# Altium schematic sheet MICROMOUSE.SchDoc
size A; SheetNumber: 1; SheetTotal: 1
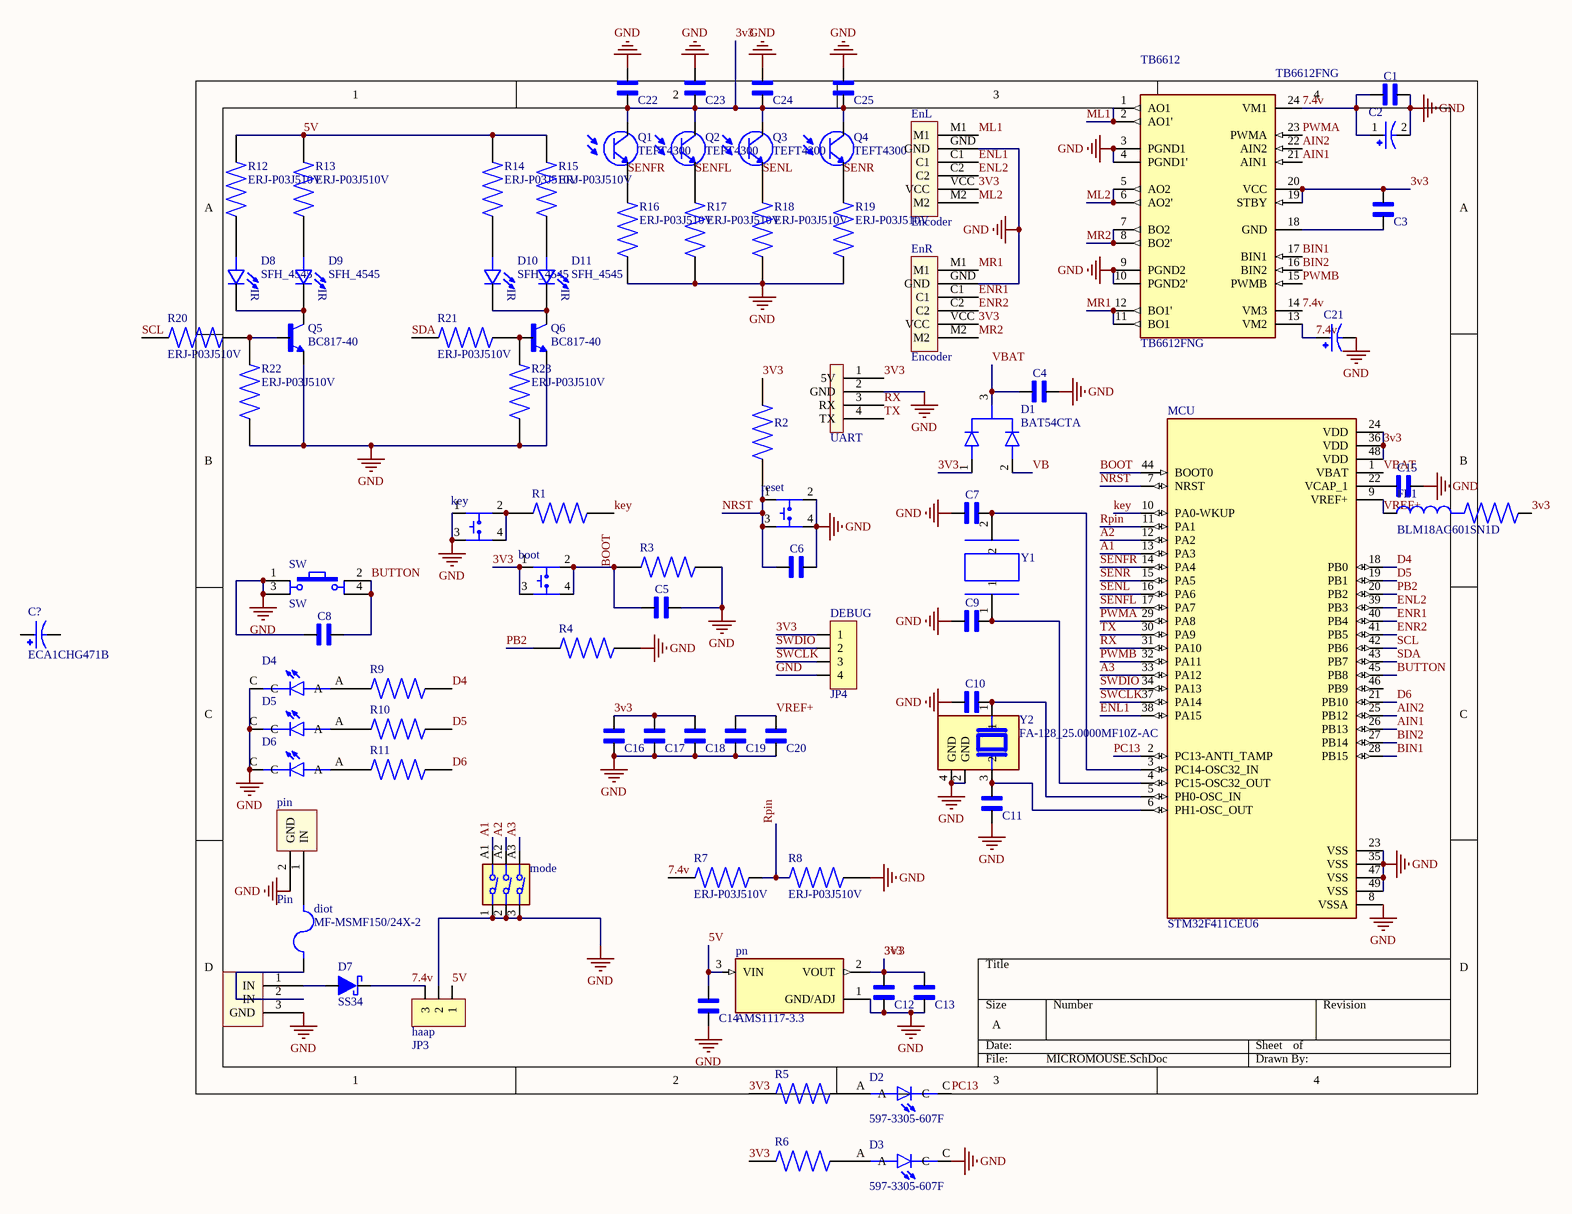
[diagram p0: MICROMOUSE.SchDoc]

## Parts
boot  SKRPACE010  [SW_SKRPACE010]  (value not drawn)
C1  C1608C0G1H100C080AA  [CAPC1608X90N]  (value not drawn)
C2  6TPE220MAZB  [CAP_6TPE220MAZB]  (value not drawn)
C3  C1608C0G1H100C080AA  [CAPC1608X90N]  (value not drawn)
C4  C1608C0G1H100C080AA  [CAPC1608X90N]  (value not drawn)
C5  C1608C0G1H100C080AA  [CAPC1608X90N]  (value not drawn)
C6  C1608C0G1H100C080AA  [CAPC1608X90N]  (value not drawn)
C7  C1608C0G1H100C080AA  [CAPC1608X90N]  (value not drawn)
C8  C1608C0G1H100C080AA  [CAPC1608X90N]  (value not drawn)
C9  C1608C0G1H100C080AA  [CAPC1608X90N]  (value not drawn)
C10  C1608C0G1H100C080AA  [CAPC1608X90N]  (value not drawn)
C11  C1608C0G1H100C080AA  [CAPC1608X90N]  (value not drawn)
C12  C1608C0G1H100C080AA  [CAPC1608X90N]  (value not drawn)
C13  C1608C0G1H100C080AA  [CAPC1608X90N]  (value not drawn)
C14  C1608C0G1H100C080AA  [CAPC1608X90N]  (value not drawn)
C15  C1608C0G1H100C080AA  [CAPC1608X90N]  (value not drawn)
C16  C1608C0G1H100C080AA  [CAPC1608X90N]  (value not drawn)
C17  C1608C0G1H100C080AA  [CAPC1608X90N]  (value not drawn)
C18  C1608C0G1H100C080AA  [CAPC1608X90N]  (value not drawn)
C19  C1608C0G1H100C080AA  [CAPC1608X90N]  (value not drawn)
C20  C1608C0G1H100C080AA  [CAPC1608X90N]  (value not drawn)
C21  EEEFK1C471GV  [CAP_EEEFK1C471GV]  (value not drawn)
C22  C1608C0G1H100C080AA  [CAPC1608X90N]  (value not drawn)
C23  C1608C0G1H100C080AA  [CAPC1608X90N]  (value not drawn)
C24  C1608C0G1H100C080AA  [CAPC1608X90N]  (value not drawn)
C25  C1608C0G1H100C080AA  [CAPC1608X90N]  (value not drawn)
C?  ECA1CHG471B  [CAPPRD500W60D800H1150]
D1  BAT54CTA  [SOT50P160X90-3N]
D2  597-3305-607F  [LEDC2012X70N]
D3  597-3305-607F  [LEDC2012X70N]
D4  597-3305-607F  [LEDC2012X70N]  (value not drawn)
D5  597-3305-607F  [LEDC2012X70N]  (value not drawn)
D6  597-3305-607F  [LEDC2012X70N]  (value not drawn)
D7  SS34  [DO214AB]
D8  SFH_4545  [DIO_SFH_4545]
D9  SFH_4545  [DIO_SFH_4545]
D10  SFH_4545  [DIO_SFH_4545]
D11  SFH_4545  [DIO_SFH_4545]
DEBUG  JP4  [JP4-C1T]
diot  MF-MSMF150/24X-2  [FUSER_MF-MSMF150/24X-2]
EnL  Encoder  [Encoder]
EnR  Encoder  [Encoder]
FL1  BLM18AG601SN1D  [BEADC1608X95N]
haap  JP3  [JP3-C1T]
key  SKRPACE010  [SW_SKRPACE010]  (value not drawn)
MCU  STM32F411CEU6  [QFN50P700X700X60-49N]
mode  418117270903  [418117270903]  (value not drawn)
pin  Pin  [Pin]
pn  AMS1117-3.3  [SOT229P700X180-4N]
Q1  TEFT4300  [XDCR_TEFT4300]
Q2  TEFT4300  [XDCR_TEFT4300]
Q3  TEFT4300  [XDCR_TEFT4300]
Q4  TEFT4300  [XDCR_TEFT4300]
Q5  BC817-40  [SOT95P240X120-3N]
Q6  BC817-40  [SOT95P240X120-3N]
R1  ERJ-P03J510V  [RESC1608X55N]  (value not drawn)
R2  ERJ-P03J510V  [RESC1608X55N]  (value not drawn)
R3  ERJ-P03J510V  [RESC1608X55N]  (value not drawn)
R4  ERJ-P03J510V  [RESC1608X55N]  (value not drawn)
R5  ERJ-P03J510V  [RESC1608X55N]  (value not drawn)
R6  ERJ-P03J510V  [RESC1608X55N]  (value not drawn)
R7  ERJ-P03J510V  [RESC1608X55N]
R8  ERJ-P03J510V  [RESC1608X55N]
R9  ERJ-P03J510V  [RESC1608X55N]  (value not drawn)
R10  ERJ-P03J510V  [RESC1608X55N]  (value not drawn)
R11  ERJ-P03J510V  [RESC1608X55N]  (value not drawn)
R12  ERJ-P03J510V  [RESC1608X55N]
R13  ERJ-P03J510V  [RESC1608X55N]
R14  ERJ-P03J510V  [RESC1608X55N]
R15  ERJ-P03J510V  [RESC1608X55N]
R16  ERJ-P03J510V  [RESC1608X55N]
R17  ERJ-P03J510V  [RESC1608X55N]
R18  ERJ-P03J510V  [RESC1608X55N]
R19  ERJ-P03J510V  [RESC1608X55N]
R20  ERJ-P03J510V  [RESC1608X55N]
R21  ERJ-P03J510V  [RESC1608X55N]
R22  ERJ-P03J510V  [RESC1608X55N]
R23  ERJ-P03J510V  [RESC1608X55N]
reset  SKRPACE010  [SW_SKRPACE010]  (value not drawn)
SW  SW  [SW4]
Sw1  Switch  [Switch]  (value not drawn)
TB6612  TB6612FNG  [SSOP24]
UART  Pin4x  [Pin4x]  (value not drawn)
Y1  ABS07-LR-32.768KHZ-6-T  [XTAL320X150X90]  (value not drawn)
Y2  FA-128_25.0000MF10Z-AC  [XTAL_FA-128_25.0000MF10Z-AC]

## Nets
GND: C1.2 C2.2 C4.2 C5.2 C6.2 C7.1 C8.1 C9.1 C10.1 C11.1 C12.1 C13.1 C14.1 C15.2 C16.1 C17.1 C18.1 C19.1 C20.1 C21.2 C22.2 C23.2 C24.2 C25.2 D3.C D4.C D5.C D6.C DEBUG.4 EnL.GND EnR.GND haap.2 key.1 key.3 MCU.8(VSSA) MCU.23(VSS) MCU.35(VSS) MCU.47(VSS) MCU.49(VSS) mode.1 mode.2 mode.3 pin.2(GND) pn.1(GND/ADJ) Q5.2(E) Q6.2(E) R3.2 R4.2 R8.2 R16.1 R17.1 R18.1 R19.1 R22.1 R23.1 reset.2 reset.4 SW.1 SW.3 Sw1.3(GND) TB6612.3(PGND1) TB6612.4(PGND1') TB6612.9(PGND2) TB6612.10(PGND2') UART.2(GND) Y2.2(GND) Y2.4(GND)
3V3: boot.1 boot.3 C3.2 C12.2 C13.2 C16.2 C17.2 C18.2 C22.1 C23.1 C24.1 C25.1 D1.1 DEBUG.1 EnL.VCC EnR.VCC FL1.2 MCU.24(VDD) MCU.36(VDD) MCU.48(VDD) pn.2(VOUT) Q1.C Q2.C Q3.C Q4.C R2.2 R5.1 R6.1 TB6612.19(STBY) TB6612.20(VCC) UART.1(5V)
5V: C14.2 haap.1 pn.3(VIN) R12.2 R13.2 R14.2 R15.2
7.4v: C1.1 C2.1 C21.1 D7.C haap.3 R7.1 TB6612.13(VM2) TB6612.14(VM3) TB6612.24(VM1)
A1: MCU.13(PA3) mode.A1
A2: MCU.12(PA2) mode.A2
A3: MCU.33(PA12) mode.A3
AIN1: MCU.26(PB13) TB6612.21(AIN1)
AIN2: MCU.25(PB12) TB6612.22(AIN2)
BIN1: MCU.28(PB15) TB6612.17(BIN1)
BIN2: MCU.27(PB14) TB6612.16(BIN2)
BOOT: boot.2 boot.4 C5.1 MCU.44(BOOT0) R3.1
BUTTON: C8.2 MCU.45(PB8) SW.2 SW.4
D4: MCU.18(PB0) R9.2
D5: MCU.19(PB1) R10.2
D6: MCU.21(PB10) R11.2
ENL1: EnL.C1 MCU.38(PA15)
ENL2: EnL.C2 MCU.39(PB3)
ENR1: EnR.C1 MCU.40(PB4)
ENR2: EnR.C2 MCU.41(PB5)
key: MCU.10(PA0-WKUP) R1.2
ML1: EnL.M1 TB6612.1(AO1) TB6612.2(AO1')
ML2: EnL.M2 TB6612.5(AO2) TB6612.6(AO2')
MR1: EnR.M1 TB6612.11(BO1) TB6612.12(BO1')
MR2: EnR.M2 TB6612.7(BO2) TB6612.8(BO2')
NRST: C6.1 MCU.7(NRST) R2.1 reset.1 reset.3
PB2: MCU.20(PB2) R4.1
PC13: D2.C MCU.2(PC13-ANTI_TAMP)
PWMA: MCU.29(PA8) TB6612.23(PWMA)
PWMB: MCU.32(PA11) TB6612.15(PWMB)
Rpin: MCU.11(PA1) R7.2 R8.1
RX: MCU.31(PA10) UART.3(RX)
SCL: MCU.42(PB6) R20.2
SDA: MCU.43(PB7) R21.2
SENFL: MCU.17(PA7) Q2.E R17.2
SENFR: MCU.14(PA4) Q1.E R16.2
SENL: MCU.16(PA6) Q3.E R18.2
SENR: MCU.15(PA5) Q4.E R19.2
SWCLK: DEBUG.3 MCU.37(PA14)
SWDIO: DEBUG.2 MCU.34(PA13)
TX: MCU.30(PA9) UART.4(TX)
VB: D1.2
VBAT: C4.1 D1.3 MCU.1(VBAT)
VREF+: C19.2 C20.2 FL1.1 MCU.9(VREF+)
NetC3_1: C3.1 TB6612.18(GND)
NetC7_2: C7.2 MCU.3(PC14-OSC32_IN) Y1.2
NetC9_2: C9.2 MCU.4(PC15-OSC32_OUT) Y1.1
NetC10_2: C10.2 MCU.5(PH0-OSC_IN) Y2.1
NetC11_2: C11.2 MCU.6(PH1-OSC_OUT) Y2.3(2)
NetC15_1: C15.1 MCU.22(VCAP_1)
NetD2_A: D2.A R5.2
NetD3_A: D3.A R6.2
NetD4_A: D4.A R9.1
NetD5_A: D5.A R10.1
NetD6_A: D6.A R11.1
NetD7_A: D7.A Sw1.1(IN)
NetD8_A: D8.A R12.1
NetD8_C: D8.C D9.C Q5.3(C)
NetD9_A: D9.A R13.1
NetD10_A: D10.A R14.1
NetD10_C: D10.C D11.C Q6.3(C)
NetD11_A: D11.A R15.1
Netdiot_1: diot.1 Sw1.2(IN)
Netdiot_2: diot.2 pin.1(IN)
Netkey_2: key.2 key.4 R1.1
NetQ5_1: Q5.1(B) R20.1 R22.2
NetQ6_1: Q6.1(B) R21.1 R23.2

Not connected (* = marked no-connect by the designer): C? N P; MCU 46(PB9)

## Notes on the sheet
- (in symbol SFH_4545) IR

## Library data of the parts
boot key reset = SKRPACE010: Switch Tactile N.O. SPST Button J-Bend 0.05A 16VDC 2.55N SMD Automotive T/R; MF: ALPS; SnapEDA_Link: https://www.snapeda.com/parts/SKRPACE010/ALPS/view-part/376136/?ref=snap; Package: None; Price: None; MP: SKRPACE010; Availability: Good; Value: *; Check_prices: https://www.snapeda.com/parts/SKRPACE010/ALPS/view-part/376136/?ref=eda
C1 C3-C20 C22-C25 = C1608C0G1H100C080AA: C Series 0603 10 pF 50 V Â±0.25 pF Tolerance C0G SMT Multilayer Ceramic Capacitor; MF: TDK; SnapEDA_Link: https://www.snapeda.com/parts/C1608C0G1H100C080AA/TDK/view-part/?ref=snap; Package: 1608 TDK; Value: *; MP: C1608C0G1H100C080AA; Check_prices: https://www.snapeda.com/parts/C1608C0G1H100C080AA/TDK/view-part/?ref=eda
C21 = EEEFK1C471GV: CAP ALUM 470UF 20% 16V SMD; MF: Panasonic; Price: None; Check_prices: https://www.snapeda.com/parts/EEEFK1C471GV/Panasonic/view-part/?ref=eda; Package: RADIAL-2 Panasonic; SnapEDA_Link: https://www.snapeda.com/parts/EEEFK1C471GV/Panasonic/view-part/?ref=snap; Purchase-URL: https://pricing.snapeda.com/search/part/EEEFK1C471GV/?ref=eda; Availability: In Stock; MP: EEEFK1C471GV; Value: *
C? = ECA1CHG471B: NHG-A; Price: None; Value: *; MP: ECA1CHG471B; Availability: Unavailable; Package: None
D1 = BAT54CTA: 200mA 30V Schottky Barrier Diode SOT-23 | Diodes Inc BAT54CTA; MF: Diodes Inc.; SnapEDA_Link: https://www.snapeda.com/parts/BAT54CTA/Diodes+Inc./view-part/?ref=snap; Package: SOT-23 Diodes Inc.; Value: *; MP: BAT54CTA; Check_prices: https://www.snapeda.com/parts/BAT54CTA/Diodes+Inc./view-part/?ref=eda
D2-D6 = 597-3305-607F: LED Uni-Color Green 4-Pin Chip 0805 T/R; Availability: Unavailable; Value: *; Price: None; MP: 597-3305-607F; Package: None
D7 = SS34: Diode Schottky 40 V 3A Surface Mount SMA; MF: MDD; SnapEDA_Link: https://www.snapeda.com/parts/SS34/MDD/view-part/?ref=snap; Package: SMC-2 ON Semiconductor; Value: *; MP: SS34; Check_prices: https://www.snapeda.com/parts/SS34/MDD/view-part/?ref=eda
D8-D11 = SFH_4545: Infrared (IR) Emitter 950nm 1.5V 100mA 550mW/sr @ 100mA 10Â° Radial; MF: OSRAM Opto; SnapEDA_Link: https://www.snapeda.com/parts/SFH%204545/OSRAM/view-part/?ref=snap; Package: None; Value: *; MP: SFH 4545; Check_prices: https://www.snapeda.com/parts/SFH%204545/OSRAM/view-part/?ref=eda
DEBUG = JP4: WR-PHD 2.54 mm Angled Socket Header; Manufacturer: W¨¹rth Elektronik eiSos GmbH; partNo: 613004143121; ComponentLink1 Description: Manufacturer; ComponentLink2 Description: Datasheet; NoPins: 04; Created Date: 29 March 2013; ComponentLink1URL: http://www.we-online.com; ComponentLink2URL: http://katalog.we-online.de/em/datasheet/6130xx143121.pdf; Created by: Karrer Zheng
diot = MF-MSMF150/24X-2: Polymeric PTC Resettable Fuse 24V 1.5 A Ih Surface Mount 1812 (4532 Metric), Concave; MF: Bourns; Check_prices: https://www.snapeda.com/parts/MF-MSMF150/24X-2/Bourns/view-part/?ref=eda; Value: *; MP: MF-MSMF150/24X-2; Purchase-URL: https://pricing.snapeda.com/search/part/MF-MSMF150/24X-2/?ref=eda; SnapEDA_Link: https://www.snapeda.com/parts/MF-MSMF150/24X-2/Bourns/view-part/?ref=snap; Package: 1812 Bourns; Digi-Key_Part_Number: MF-MSMF150/24X-2TR-ND
FL1 = BLM18AG601SN1D: 600 Ohms @ 100 MHz 1 - Ferrite Bead 0603 (1608 Metric) 500mA 380mOhm; MF: Murata; Check_prices: https://www.snapeda.com/parts/BLM18AG601SN1D/Murata/view-part/?ref=eda; SnapEDA_Link: https://www.snapeda.com/parts/BLM18AG601SN1D/Murata/view-part/?ref=snap; Availability: In Stock; Value: *; Price: None; MP: BLM18AG601SN1D; Package: 1608 Murata; Purchase-URL: https://pricing.snapeda.com/search/part/BLM18AG601SN1D/?ref=eda
haap = JP3: WR-PHD 2.54 mm Angled Socket Header; Manufacturer: W¨¹rth Elektronik eiSos GmbH; partNo: 613003143121; ComponentLink1 Description: Manufacturer; ComponentLink2 Description: Datasheet; NoPins: 03; Created Date: 29 March 2013; ComponentLink1URL: http://www.we-online.com; ComponentLink2URL: http://katalog.we-online.de/em/datasheet/6130xx143121.pdf; Created by: Karrer Zheng
MCU = STM32F411CEU6: High-performance access line, ARM Cortex-M4 core with DSP and FPU, 512 Kbytes Flash, 100 MHz CPU, ART Accelerator; Package: None; Availability: Unavailable; Value: *; MP: STM32F411CEU6; Price: None
mode = 418117270903: Dip Switch SPST 3 Position Through Hole Slide (Standard) Actuator 25mA 24VDC; MF: WÃ¼rth Elektronik; SnapEDA_Link: https://www.snapeda.com/parts/418117270903/W%25C3%25BCrth+Elektronik+Midcom/view-part/?ref=snap; Package: None; Value: *; MP: 418117270903; Check_prices: https://www.snapeda.com/parts/418117270903/W%25C3%25BCrth+Elektronik+Midcom/view-part/?ref=eda
pn = AMS1117-3.3: Sot223/Pkg 1-Amp 3.3-Volt Low Drop Out Voltage Regulatator; MF: Advanced Monolithic Systems; SnapEDA_Link: https://www.snapeda.com/parts/AMS1117-3.3/Advanced+Monolithic+Systems/view-part/?ref=snap; Package: SOT-223 Seeed Technology; Value: *; MP: AMS1117-3.3; Check_prices: https://www.snapeda.com/parts/AMS1117-3.3/Advanced+Monolithic+Systems/view-part/?ref=eda
Q1-Q4 = TEFT4300: Phototransistors 925nm Top View Radial, 3mm Dia (T-1); MF: Vishay Semiconductor; SnapEDA_Link: https://www.snapeda.com/parts/TEFT4300/Vishay/view-part/?ref=snap; Package: None; Value: *; MP: TEFT4300; Check_prices: https://www.snapeda.com/parts/TEFT4300/Vishay/view-part/?ref=eda
Q5 Q6 = BC817-40: BJT, SOT-23, 45V, 800mA, NPN, 0.31W, 150Â°C; MF: Diotec Semiconductor; SnapEDA_Link: https://www.snapeda.com/parts/BC817-40/Diotec/view-part/?ref=snap; Package: SOT-23 Diotec; Value: *; MP: BC817-40; Check_prices: https://www.snapeda.com/parts/BC817-40/Diotec/view-part/?ref=eda
R1-R23 = ERJ-P03J510V: Anti-Surge Chip Resistor 0603 5%, 51ohm , T&R; MF: Panasonic; SnapEDA_Link: https://www.snapeda.com/parts/ERJ-P03J510V/Panasonic/view-part/?ref=snap; Package: 1608-2 Panasonic; Value: *; MP: ERJ-P03J510V; Check_prices: https://www.snapeda.com/parts/ERJ-P03J510V/Panasonic/view-part/?ref=eda
SW = SW4: Switch button 4 pin; Value: Button chip 4 pin
TB6612 = TB6612FNG: - Motor Driver Power MOSFET Parallel 24-SSOP; MF: Toshiba; SnapEDA_Link: https://www.snapeda.com/parts/TB6612FNG/Toshiba/view-part/?ref=snap; Package: None; Value: *; MP: TB6612FNG; Check_prices: https://www.snapeda.com/parts/TB6612FNG/Toshiba/view-part/?ref=eda
Y1 = ABS07-LR-32.768KHZ-6-T: 32.768 kHz Â±20ppm Crystal 6pF 50 kOhms 2-SMD, No Lead; MF: Abracon; SnapEDA_Link: https://www.snapeda.com/parts/ABS07-LR-32.768KHZ-6-T/Abracon/view-part/?ref=snap; Package: SMD-2 Abracon; Value: *; MP: ABS07-LR-32.768KHZ-6-T; Check_prices: https://www.snapeda.com/parts/ABS07-LR-32.768KHZ-6-T/Abracon/view-part/?ref=eda
Y2 = FA-128_25.0000MF10Z-AC: 25 MHz Â±10ppm Crystal 9pF 80 Ohms 4-SMD, No Lead; MF: EPSON; MP: FA-128 25.0000MF10Z-AC; Package: NON STANDARD-4 EPSON; Price: None; Check_prices: https://www.snapeda.com/parts/FA-128%2025.0000MF10Z-AC/EPSON/view-part/?ref=eda; Value: *; SnapEDA_Link: https://www.snapeda.com/parts/FA-128%2025.0000MF10Z-AC/EPSON/view-part/?ref=snap; Availability: In Stock; Purchase-URL: https://pricing.snapeda.com/search/part/FA-128 25.0000MF10Z-AC/?ref=eda
C2 = 6TPE220MAZB: Availability: Unavailable; Price: None; Value: *; MP: 6TPE220MAZB; Package: None